# EAGLE design Simulador Sensor Hall (EAGLE 9.6.2)
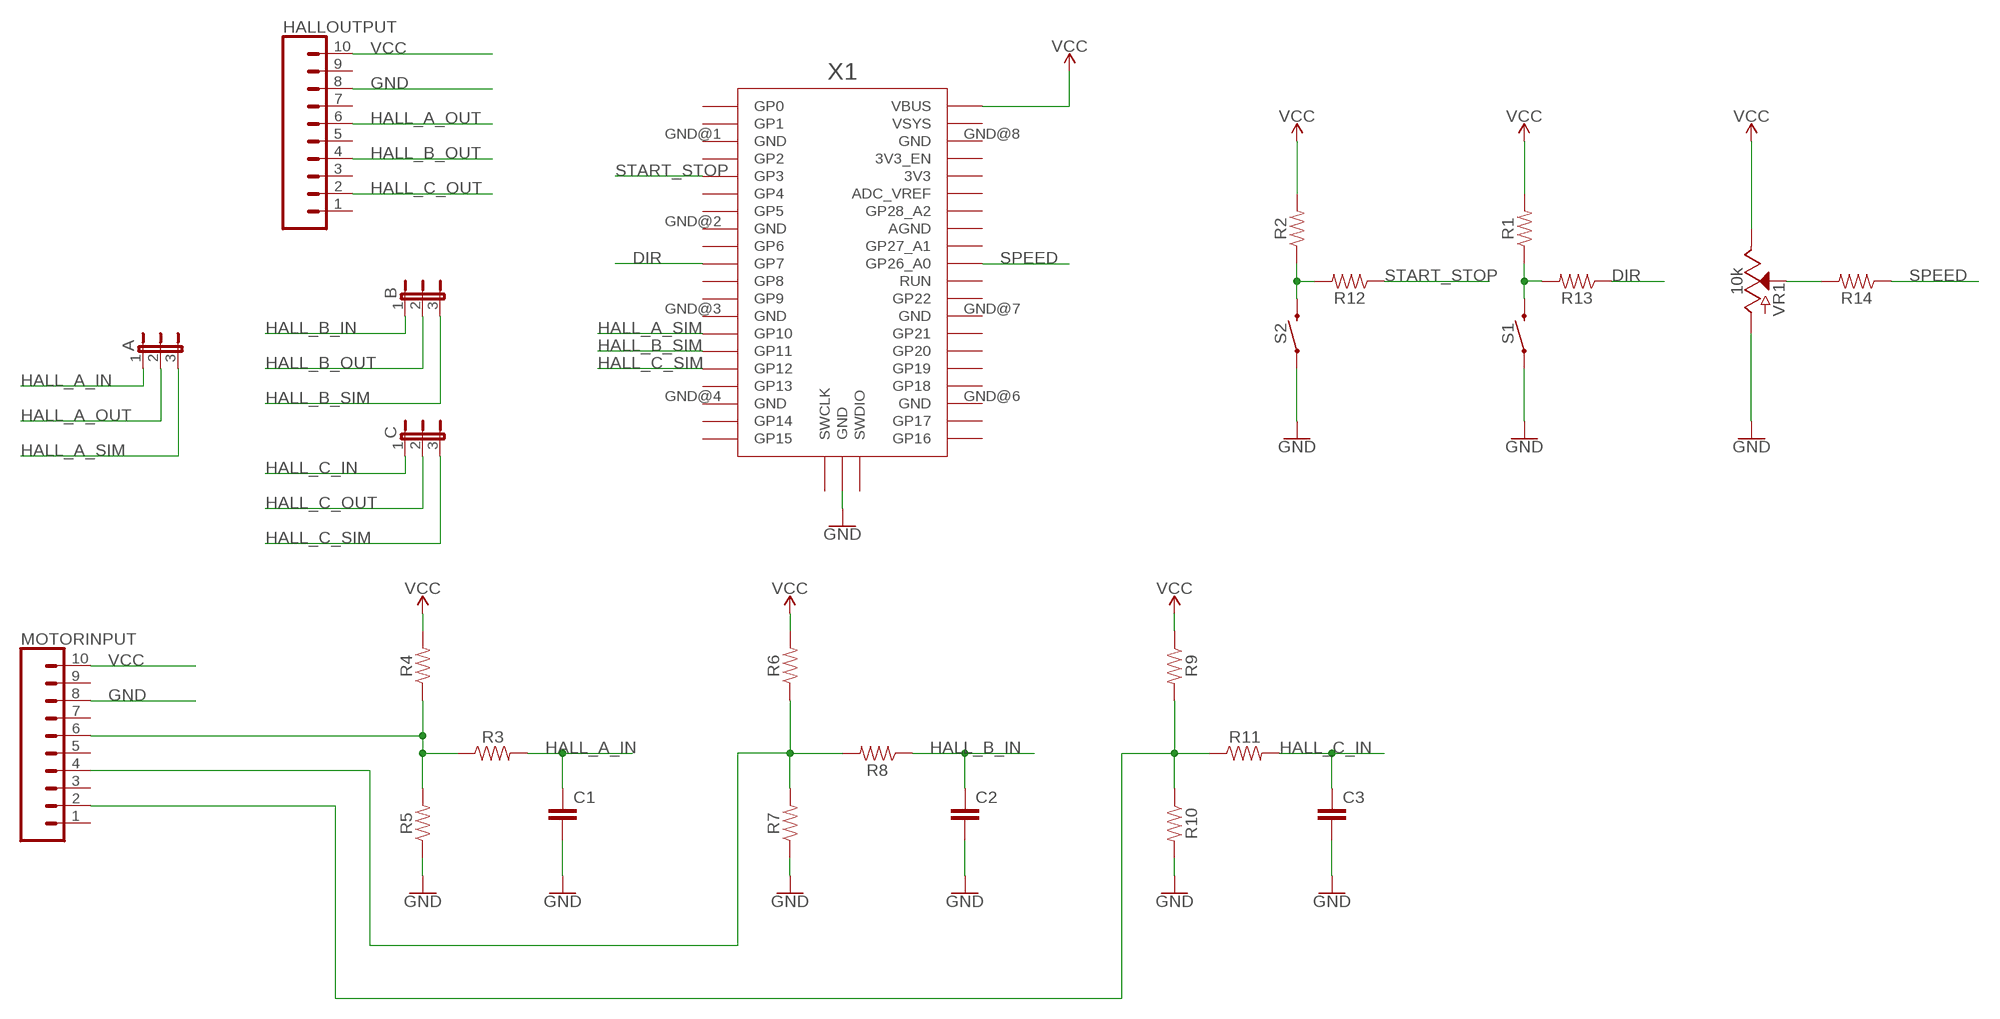
[diagram p0: schematic, sheet 1]

## Parts
A  JP2E  [JP2]
B  JP2E  [JP2]
C  JP2E  [JP2]
C1  C-EUC0805K  [C0805K]
C2  C-EUC0805K  [C0805K]
C3  C-EUC0805K  [C0805K]
HALLOUTPUT  CONN_10"  [1X10]
MOTORINPUT  CONN_10"  [1X10]
R1  RESISTOR0805  [0805]
R2  RESISTOR0805  [0805]
R3  RESISTOR0805  [0805]
R4  RESISTOR0805  [0805]
R5  RESISTOR0805  [0805]
R6  RESISTOR0805  [0805]
R7  RESISTOR0805  [0805]
R8  RESISTOR0805  [0805]
R9  RESISTOR0805  [0805]
R10  RESISTOR0805  [0805]
R11  RESISTOR0805  [0805]
R12  RESISTOR0805  [0805]
R13  RESISTOR0805  [0805]
R14  RESISTOR0805  [0805]
S1  MOMENTARY-SWITCH-SPST-SMD-6.2MM-TALL  [TACTILE_SWITCH_SMD_6.2MM_TALL]
S2  MOMENTARY-SWITCH-SPST-SMD-6.2MM-TALL  [TACTILE_SWITCH_SMD_6.2MM_TALL]
VR1  10k  POTENTIOMETER-PTH-9MM-1/20W-20%  [POT-PTH-ALPS]
X1  RPI_PICO_IG-TH  [RPI_PICO_TH]

## Nets
DIR: R13.1 X1.GP7
GND: C1.2 C2.2 C3.2 HALLOUTPUT.8 MOTORINPUT.8 R5.1 R7.1 R10.2 S1.A2 S2.A2 VR1.P$3(A) X1.GND@5(GND)
HALL_A_IN: A.1 C1.1 R3.2
HALL_A_OUT: A.2 HALLOUTPUT.6
HALL_A_SIM: A.3 X1.GP10
HALL_B_IN: B.1 C2.1 R8.1
HALL_B_OUT: B.2 HALLOUTPUT.4
HALL_B_SIM: B.3 X1.GP11
HALL_C_IN: C3.1 C.1 R11.2
HALL_C_OUT: C.2 HALLOUTPUT.2
HALL_C_SIM: C.3 X1.GP12
N$1: MOTORINPUT.6 R3.1 R4.1 R5.2
N$2: MOTORINPUT.4 R6.1 R7.2 R8.2
N$3: MOTORINPUT.2 R9.2 R10.1 R11.1
N$4: R2.1 R12.2 S2.B2
N$6: R1.1 R13.2 S1.B2
N$8: R14.2 VR1.P$2(S)
SPEED: R14.1 X1.GP26_A0
START_STOP: R12.1 X1.GP3
VCC: HALLOUTPUT.10 MOTORINPUT.10 R1.2 R2.2 R4.2 R6.2 R9.1 VR1.P$1(E) X1.VBUS
Unconnected: HALLOUTPUT.1 HALLOUTPUT.3 HALLOUTPUT.5 HALLOUTPUT.7 HALLOUTPUT.9 MOTORINPUT.1 MOTORINPUT.3 MOTORINPUT.5 MOTORINPUT.7 MOTORINPUT.9 X1.3V3 X1.3V3_EN X1.ADC_VREF X1.AGND X1.GND@1(GND) X1.GND@2(GND) X1.GND@3(GND) X1.GND@4(GND) X1.GND@6(GND) X1.GND@7(GND) X1.GND@8(GND) X1.GP0 X1.GP1 X1.GP2 X1.GP4 X1.GP5 X1.GP6 X1.GP8 X1.GP9 X1.GP13 X1.GP14 X1.GP15 X1.GP16 X1.GP17 X1.GP18 X1.GP19 X1.GP20 X1.GP21 X1.GP22 X1.GP27_A1 X1.GP28_A2 X1.RUN X1.SWCLK X1.SWDIO X1.VSYS

## Library data of the parts
A B C = jumper:JP2E: JUMPER
C1-C3 = rcl:C-EU: CAPACITOR, European symbol; SPICEPREFIX: C
HALLOUTPUT MOTORINPUT = SparkFun-Connectors:CONN_10: Multi connection point. Often used as Generic Header-pin footprint for 0.1 inch spaced/style header connections On any of the 0.1 inch spaced packages, you can populate with these: Break Away Headers - Straight <https://www.sparkfun.com/products/116> (PRT-00116) Break Away Male Headers - Right Angle <https://www.sparkfun.com/products/553> (PRT-00553) Female Headers <https://www.sparkfun.com/products/115> (PRT-00115) Break Away Headers - Machine Pin <https://www.sparkfun.com/products/117> (PRT-00117) Break Away Female Headers - Swiss Machine Pin <https://www.sparkfun.com/products/743> (PRT-00743) Arduino Stackable Header - 10 Pin <https://www.sparkfun.com/products/11376> (PRT-11376) For SCREWTERMINALS and SPRING TERMINALS visit here: Screw Terimnals on SparkFun.com <https://www.sparkfun.com/search/results?term=Screw+Terminals> (5mm/3.5mm/2.54mm spacing) This device is also useful as a general connection point to wire up your design to another part of your project. Our various solder wires solder well into these plated through hole pads. Hook-Up Wire - Assortment (Stranded, 22 AWG) <https://www.sparkfun.com/products/11375> (PRT-11375) Hook-Up Wire - Assortment (Solid Core, 22 AWG) <https://www.sparkfun.com/products/11367> (PRT-11367) View the entire wire category on our website here <https://www.sparkfun.com/categories/141> Special notes: Molex polarized connector foot print use with SKU : PRT-08231 with associated crimp pins and housings. 1MM SMD Version SKU: PRT-10208 NOTES ON THE VARIANTS LOCK and LOCK_LONGPADS... This footprint was designed to help hold the alignment of a through-hole component (i.e. 6-pin header) while soldering it into place. You may notice that each hole has been shifted either up or down by 0.005 of an inch from it's more standard position (which is a perfectly straight line). This slight alteration caused the pins (the squares in the middle) to touch the edges of the holes. Because they are alternating, it causes a "brace" to hold the component in place. 0.005 has proven to be the perfect amount of "off-center" position when using our standard breakaway headers. Although looks a little odd when you look at the bare footprint, once you have a header in there, the alteration is very hard to notice. Also,if you push a header all the way into place, it is covered up entirely on the bottom side.; PROD_ID: CONN-11563
R1-R14 = SparkFun-Resistors:RESISTOR: Generic Resistor Package
S1 S2 = SparkFun-Switches:MOMENTARY-SWITCH-SPST: Momentary Switch (Pushbutton) - SPST Normally-open (NO) SPST momentary switches (buttons, pushbuttons). Variants PTH-12MM - 12mm square, through-hole Momentary Pushbutton Switch - 12mm Square <https://www.sparkfun.com/products/9190> (COM-09190) PTH-6.0MM, PTH-6.0MM-KIT - 6.0mm square, through-hole Mini Pushbutton Switch <https://www.sparkfun.com/products/97> (COM-00097) KIT package intended for soldering kit's - only one side of pads' copper is exposed. PTH-RIGHT-ANGLE-KIT - Right-angle, through-hole Right Angle Tactile Button <https://www.sparkfun.com/products/10791> - Used on SparkFun BigTime Watch Kit <https://www.sparkfun.com/products/11734> SMD-12MM - 12mm square, surface-mount Tactile Button - SMD (12mm) <https://www.sparkfun.com/products/12993> (COM-12993) Used on SparkFun PicoBoard <https://www.sparkfun.com/products/11888> SMD-4.5MM - 4.5mm Square Trackball Switch Used on SparkFun Blackberry Trackballer Breakout <https://www.sparkfun.com/products/13169> SMD-4.6MMX2.8MM - 4.60mm x 2.80mm, surface mount Used on SparkFun SAMD21 Mini Breakout <https://www.sparkfun.com/products/13664> SMD-5.2MM, SMD-5.2-REDUNDANT - 5.2mm square, surface-mount Mini Pushbutton Switch - SMD <https://www.sparkfun.com/products/8720> (COM-08720) Used on Arduino Pro Mini <https://www.sparkfun.com/products/11114> REDUNDANT package connects both switch circuits together SMD-6.0X3.5MM - 6.0 x 3.5mm, surface mount Momentary Reset Switch SMD <https://www.sparkfun.com/products/8229> (COM-08229) SMD-6.2MM-TALL - 6.2mm square, surface mount Tactile Button - SMD (6mm) <https://www.sparkfun.com/products/12992> Used on SparkFun Digital Sandbox <https://www.sparkfun.com/products/12651> SMD-RIGHT-ANGLE - Right-angle, surface mount Used on SparkFun Block for Intel® Edison - Arduino <https://www.sparkfun.com/products/13036>; PROD_ID: SWCH-11966; SF_SKU: COM-12992
VR1 = SparkFun-Resistors:POTENTIOMETER: Potentiometer (Pot) Three-terminal potentiometers, with an adjustable wiper and two adjustable resistors. A pot can be used to create a configurable voltage divider, or as a variable resistor. Variants ALPS_POT and ALPS_POT_KIT - PTH, breadboard compatible, 9mm square pots Rotary Potentiometer - Linear (10k ohm) <https://www.sparkfun.com/products/9288> (COM-09288) The KIT variant exposes copper on only one side of the PTH pad, so the part can only be assembled on one side of the PCB. Useful for beginner soldering kits.; PROD_ID: RES-09177; SF_SKU: COM-09288
X1 = RaspberryPi_Pico:RPI_PICO_IG

## Board
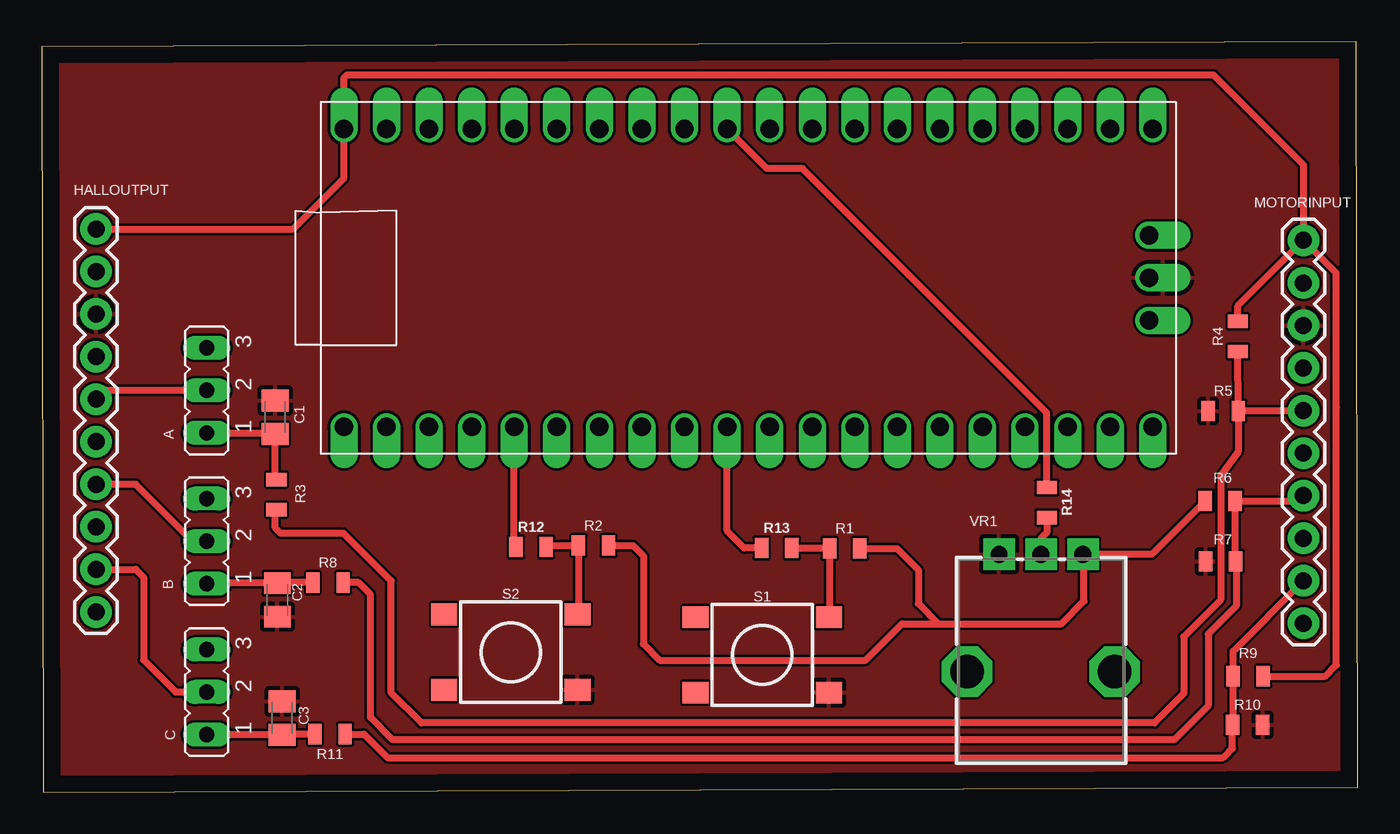
[diagram p1: board, top side]
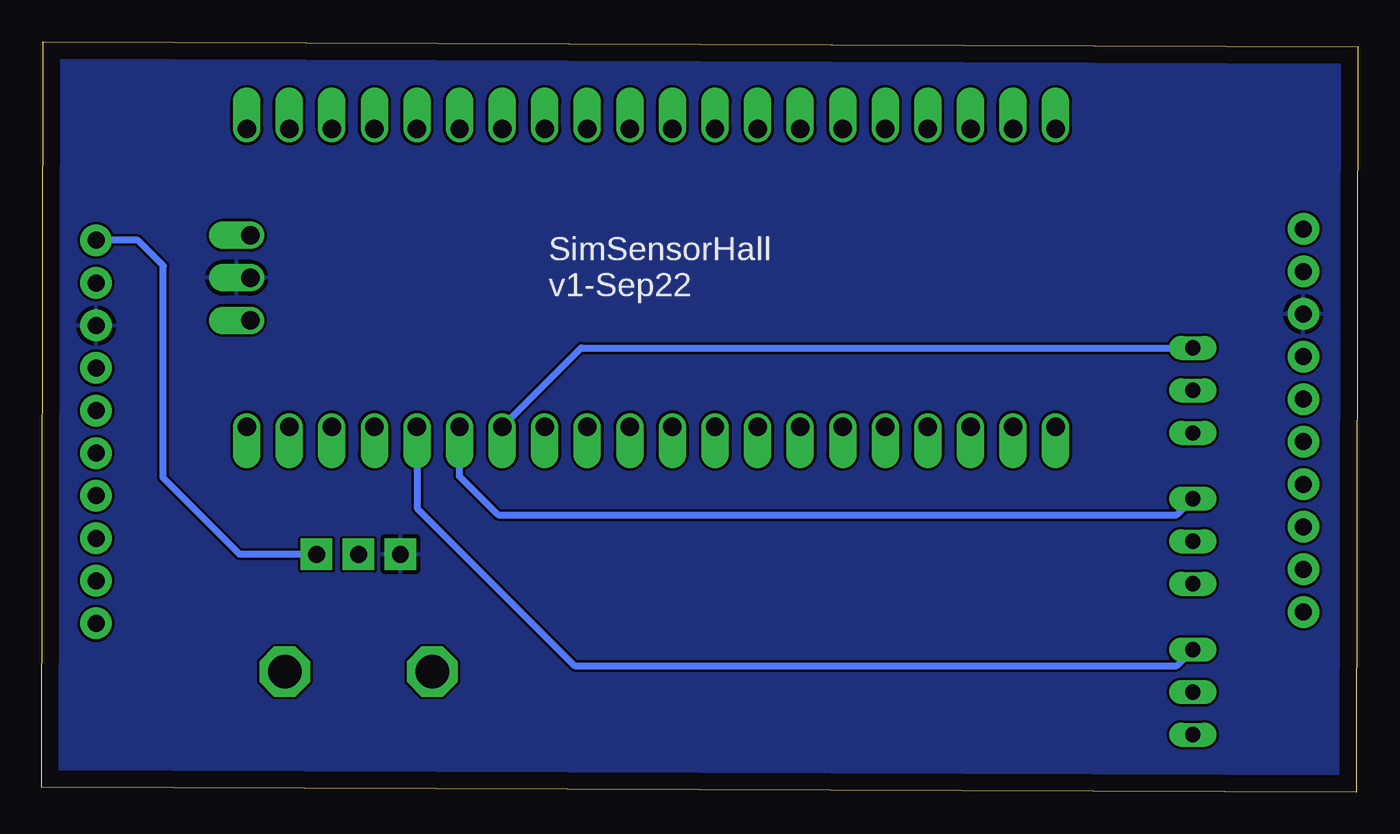
[diagram p2: board, bottom side, seen from below]

Size 78.5 x 44.77 mm. Coordinates in mm from the lower left corner, seen from the top.
Outline: 0.08,0 78.5,0.3 78.42,44.77 0,44.47 0.08,0
Copper layers (1*16): Top 0.035mm / dielectric 1.5mm / Bottom 0.035mm
Design rules "default": minimum track width 6mil, minimum drill 0.35mm, track to track 6mil, track to pad 6mil, pad to pad 6mil, via to via 6mil, smd to smd 6mil, copper to edge 40mil, drill to drill 6mil, minimum pad ring 10mil, minimum via ring 8mil, stop-mask expansion 4mil, vias tented up to drill 0mil, thermal gap 10mil

### Footprints (pad centres in the part's own frame; a part is rotated, then mirrored left to right if it is on the bottom)
JP2 = drill 0.914 long: 1 -2.54,0; 2 0,0; 3 2.54,0
C0805K = smd 1.3 x 1.6: 1 -1,0; 2 1,0
1X10 = drill 1.016 pad 1.88: 1 0,0; 2 2.54,0; 3 5.08,0; 4 7.62,0; 5 10.16,0; 6 12.7,0; 7 15.24,0; 8 17.78,0; 9 20.32,0; 10 22.86,0
0805 = smd 0.8 x 1.2: 1 -0.9,0; 2 0.9,0
TACTILE_SWITCH_SMD_6.2MM_TALL = smd 1.55 x 1.3: A1 -3.975,-2.25; A2 3.975,-2.25; B1 -3.975,2.25; B2 3.975,2.25
POT-PTH-ALPS = drill 1 pad 1.88 square: P$1 7,-2.5; P$2 7,0; P$3 7,2.5 | drill 2 octagon: P$4 0,-4.4; P$5 0,4.4
RPI_PICO_TH = drill 1.1 pad 1.6 offset: 3V3 8.89,13.97; 3V3_EN 8.89,16.51; ADC_VREF 8.89,11.43; AGND 8.89,6.35; GND@1 -8.89,19.05; GND@2 -8.89,6.35; GND@3 -8.89,-6.35; GND@4 -8.89,-19.05; GND@5 0,-23.9; GND@6 8.89,-19.05; GND@7 8.89,-6.35; GND@8 8.89,19.05; GP0 -8.89,24.13; GP1 -8.89,21.59; GP2 -8.89,16.51; GP3 -8.89,13.97; GP4 -8.89,11.43; GP5 -8.89,8.89; GP6 -8.89,3.81; GP7 -8.89,1.27; GP8 -8.89,-1.27; GP9 -8.89,-3.81; GP10 -8.89,-8.89; GP11 -8.89,-11.43; GP12 -8.89,-13.97; GP13 -8.89,-16.51; GP14 -8.89,-21.59; GP15 -8.89,-24.13; GP16 8.89,-24.13; GP17 8.89,-21.59; GP18 8.89,-16.51; GP19 8.89,-13.97; GP20 8.89,-11.43; GP21 8.89,-8.89; GP22 8.89,-3.81; GP26_A0 8.89,1.27; GP27_A1 8.89,3.81; GP28_A2 8.89,8.89; RUN 8.89,-1.27; SWCLK -2.54,-23.9; SWDIO 2.54,-23.9; VBUS 8.89,24.13; VSYS 8.89,21.59

### Placement (x,y rotation side)
A  9.83,23.97 90 top
B  9.83,14.97 90 top
C  9.83,5.97 90 top
C1  13.91,22.37 90 top
C2  14.05,11.47 270 top
C3  14.33,4.42 90 top
HALLOUTPUT  3.23,10.75 90 top
MOTORINPUT  75.27,10.07 90 top
R1  47.9,14.54 0 top
R2  32.91,14.71 0 top
R3  13.99,17.75 90 top
R4  71.36,27.19 90 top
R5  70.48,22.75 0 top
R6  70.3,17.38 180 top
R7  70.33,13.77 0 top
R8  17.07,12.5 0 top
R9  71.97,6.92 180 top
R10  71.93,4.02 0 top
R11  17.19,3.46 180 top
R12  29.18,14.63 0 top
R13  43.84,14.57 0 top
R14  59.96,17.28 270 top
S1  42.98,8.19 0 top
S2  27.98,8.35 0 top
VR1  59.61,7.19 90 top
X1  42.15,30.69 90 top

### Tracks (layer width: path | path; a pad name or v marks a point on that pad's centre or on a via)
DIR
  Top 0.406: X1.GP7 40.88,15.59 41.9,14.57 R13.1
GND
  pour Top: -1.12,45.62 79.42,45.62 79.42,-0.85 -1.08,-1 -1.12,0.64
  pour Bottom: -1.05,44.62 78.42,44.62 78.42,-1.96 -1.05,-5.68
HALL_A_IN
  Top 0.406: R3.2 13.91,18.73 C1.1 13.85,21.43 A.1
HALL_A_OUT
  Top 0.406: A.2 3.75,23.97 HALLOUTPUT.6
HALL_A_SIM
  Bottom 0.406: X1.GP10 46.33,26.51 A.3
HALL_B_IN
  Top 0.406: R8.1 14.08,12.5 C2.1 9.87,12.47 B.1
HALL_B_OUT
  Top 0.406: B.2 9.01,14.97 5.61,18.37 HALLOUTPUT.4
HALL_B_SIM
  Bottom 0.406: B.3 10.8,16.54 51.27,16.54 53.58,18.85 X1.GP11
HALL_C_IN
  Top 0.406: C.1 C3.1 14.37,3.46 R11.2
HALL_C_OUT
  Top 0.406: HALLOUTPUT.2 5.6,13.29 6.07,12.82 6.07,7.88 7.98,5.97 C.2
HALL_C_SIM
  Bottom 0.406: X1.GP12 56.11,16.94 46.71,7.54 10.8,7.54 C.3
N$1
  Top 0.406: R5.2 71.4,22.77 MOTORINPUT.6 | R5.2 R4.1 | R5.2 71.38,20.34 70.34,18.89 70.34,11.48 68.13,9.28 68.13,5.88 66.38,4.13 22.64,4.13 20.84,5.93 20.84,12.61 18,15.45 14.24,15.45 13.92,15.77 13.92,16.78 R3.1
N$2
  Top 0.406: MOTORINPUT.4 74.96,17.38 R6.1 71.2,14.79 R7.2 71.25,13.72 71.25,11.1 69.59,9.45 69.58,9.44 69.58,5.14 67.57,3.13 20.92,3.13 19.6,4.45 19.6,11.79 18.89,12.5 R8.2
N$3
  Top 0.406: R11.1 19.22,3.46 20.62,2.06 70.48,2.06 71.03,2.61 R10.1 71.07,4.63 R9.2 71.07,8.41 MOTORINPUT.2
N$4
  Top 0.406: R12.2 30.16,14.71 R2.1 32.01,10.66 S2.B2
N$6
  Top 0.406: R13.2 44.77,14.54 R1.1 47,10.49 S1.B2
N$8
  Top 0.406: R14.2 59.96,15.49 59.61,15.14 VR1.P$2
SPEED
  Top 0.406: X1.GP26_A0 43.25,37.21 45.38,37.21 59.94,22.65 59.94,18.2 R14.1
START_STOP
  Top 0.406: R12.1 28.18,14.73 X1.GP3
VCC
  Top 0.406: R2.2 35.28,14.71 35.89,14.1 35.89,8.84 36.86,7.87 49.14,7.87 51.32,10.05 53.49,10.05 | 53.49,10.05 60.83,10.05 62.18,11.4 62.18,14.12 VR1.P$1 66.21,14.19 R6.2 | R1.2 51.02,14.54 52.29,13.27 52.29,11.25 53.49,10.05 | HALLOUTPUT.10 14.98,33.61 18.02,36.65 X1.VBUS 18.02,42.62 18.21,42.81 69.9,42.81 75.27,37.44 MOTORINPUT.10 | R9.1 76.57,6.92 77.24,7.59 77.24,22.98 77.23,30.97 MOTORINPUT.10 | R4.2 71.36,29.02 MOTORINPUT.10
  Bottom 0.406: VR1.P$1 66.71,14.19 71.27,18.75 71.27,31.39 71.25,31.41 72.77,32.93 MOTORINPUT.10

### Text on the board
bPlace: SimSensorHall / v1-Sep22